# EAGLE schematic Sturingsschakeling_schema_v2.1 (EAGLE 9.7.0)
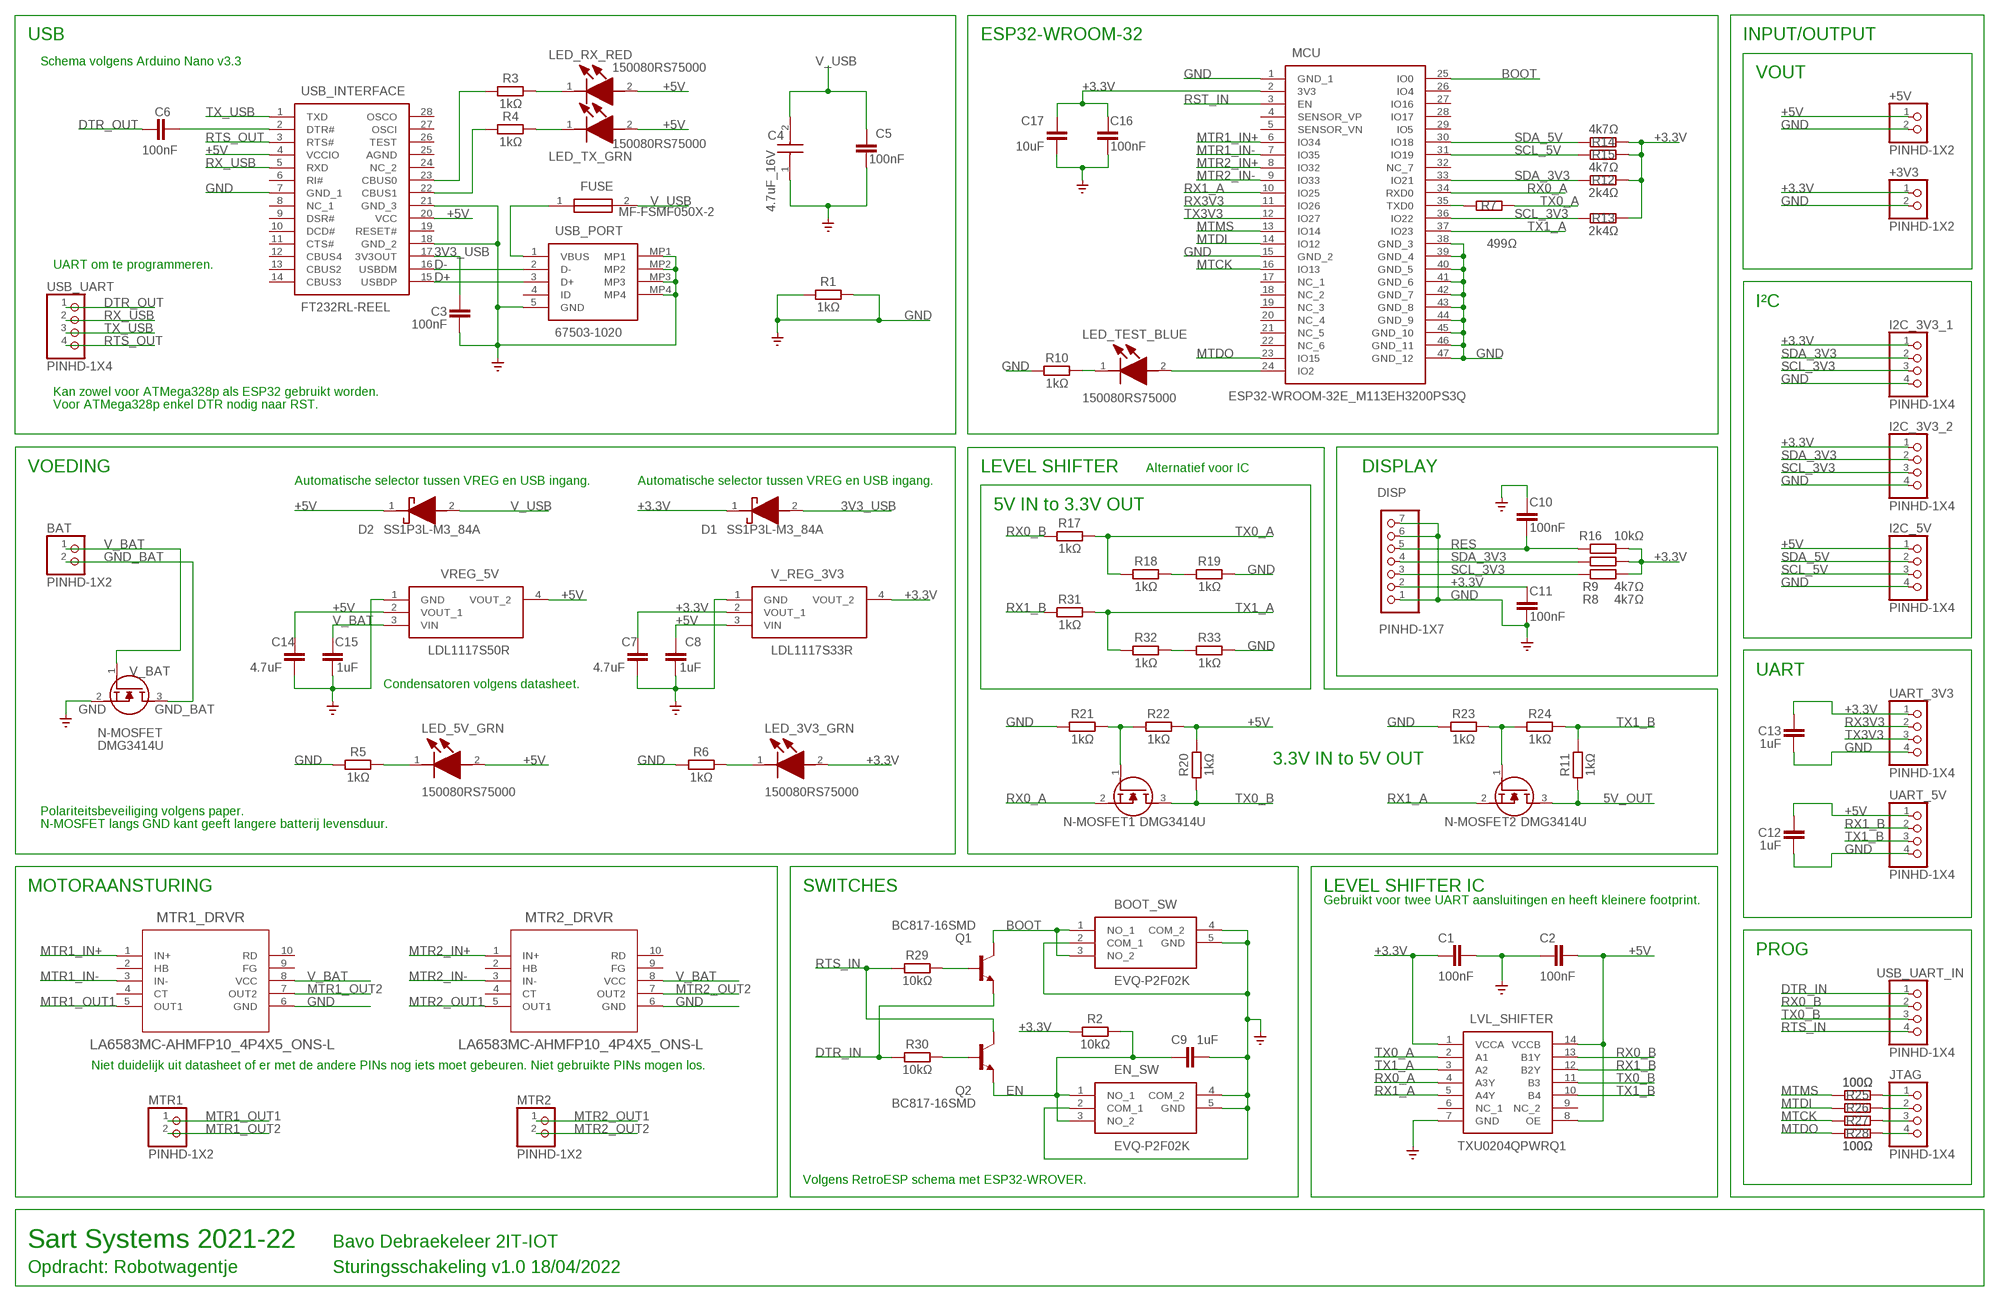
[diagram p0: schematic, sheet 1]

## Parts
+3V3  PINHD-1X2  [1X02]
+5V  PINHD-1X2  [1X02]
BAT  PINHD-1X2  [1X02]
BOOT_SW  EVQ-P2F02K  [EVQP2V02W]
C1  100nF  C_CHIP-0805(2012-METRIC)  [CAPC2012X110]
C2  100nF  C_CHIP-0805(2012-METRIC)  [CAPC2012X110]
C3  100nF  C_CHIP-0805(2012-METRIC)  [CAPC2012X110]
C4  4.7uF_16V  CC0805ZKY5V7BB475  [CAPC2012X145N]
C5  100nF  C_CHIP-0805(2012-METRIC)  [CAPC2012X110]
C6  100nF  C_CHIP-0805(2012-METRIC)  [CAPC2012X110]
C7  4.7uF  C_CHIP-0805(2012-METRIC)  [CAPC2012X110]
C8  1uF  C_CHIP-0805(2012-METRIC)  [CAPC2012X110]
C9  1uF  C_CHIP-0805(2012-METRIC)  [CAPC2012X110]
C10  100nF  C_CHIP-0805(2012-METRIC)  [CAPC2012X110]
C11  100nF  C_CHIP-0805(2012-METRIC)  [CAPC2012X110]
C12  1uF  C_CHIP-0805(2012-METRIC)  [CAPC2012X110]
C13  1uF  C_CHIP-0805(2012-METRIC)  [CAPC2012X110]
C14  4.7uF  C_CHIP-0805(2012-METRIC)  [CAPC2012X110]
C15  1uF  C_CHIP-0805(2012-METRIC)  [CAPC2012X110]
C16  100nF  C_CHIP-0805(2012-METRIC)  [CAPC2012X110]
C17  10uF  C_CHIP-0805(2012-METRIC)  [CAPC2012X110]
D1  SS1P3L-M3_84A  [SS1P3LM384A]
D2  SS1P3L-M3_84A  [SS1P3LM384A]
DISP  PINHD-1X7  [1X07]
EN_SW  EVQ-P2F02K  [EVQP2V02W]
FUSE  MF-FSMF050X-2  [FUSC1608X100N]
I2C_3V3_1  PINHD-1X4  [1X04]
I2C_3V3_2  PINHD-1X4  [1X04]
I2C_5V  PINHD-1X4  [1X04]
JTAG  PINHD-1X4  [1X04]
LED_3V3_GRN  150080RS75000  [LEDC2012X80N]
LED_5V_GRN  150080RS75000  [LEDC2012X80N]
LED_RX_RED  150080RS75000  [LEDC2012X80N]
LED_TEST_BLUE  150080RS75000  [LEDC2012X80N]
LED_TX_GRN  150080RS75000  [LEDC2012X80N]
LVL_SHIFTER  TXU0204QPWRQ1  [SOP65P640X120-14N]
MCU  ESP32-WROOM-32E_M113EH3200PS3Q  [ESP32WROOM32EM113EH3200PS3Q0]
MTR1  PINHD-1X2  [1X02]
MTR1_DRVR  LA6583MC-AHMFP10_4P4X5_ONS-L  [MFP10_4P4X5_ONS-L]
MTR2  PINHD-1X2  [1X02]
MTR2_DRVR  LA6583MC-AHMFP10_4P4X5_ONS-L  [MFP10_4P4X5_ONS-L]
N-MOSFET  DMG3414U  [SOT96P240X110-3N]
N-MOSFET1  DMG3414U  [SOT96P240X110-3N]
N-MOSFET2  DMG3414U  [SOT96P240X110-3N]
Q1  BC817-16SMD  [SOT23-BEC]
Q2  BC817-16SMD  [SOT23-BEC]
R1  1kΩ  R_CHIP-0805(2012-METRIC)  [RESC2012X65]
R2  10kΩ  R_CHIP-0805(2012-METRIC)  [RESC2012X65]
R3  1kΩ  R_CHIP-0805(2012-METRIC)  [RESC2012X65]
R4  1kΩ  R_CHIP-0805(2012-METRIC)  [RESC2012X65]
R5  1kΩ  R_CHIP-0805(2012-METRIC)  [RESC2012X65]
R6  1kΩ  R_CHIP-0805(2012-METRIC)  [RESC2012X65]
R7  499Ω  R_CHIP-0805(2012-METRIC)  [RESC2012X65]
R8  4k7Ω  R_CHIP-0805(2012-METRIC)  [RESC2012X65]
R9  4k7Ω  R_CHIP-0805(2012-METRIC)  [RESC2012X65]
R10  1kΩ  R_CHIP-0805(2012-METRIC)  [RESC2012X65]
R11  1kΩ  R_CHIP-0805(2012-METRIC)  [RESC2012X65]
R12  2k4Ω  R_CHIP-0805(2012-METRIC)  [RESC2012X65]
R13  2k4Ω  R_CHIP-0805(2012-METRIC)  [RESC2012X65]
R14  4k7Ω  R_CHIP-0805(2012-METRIC)  [RESC2012X65]
R15  4k7Ω  R_CHIP-0805(2012-METRIC)  [RESC2012X65]
R16  10kΩ  R_CHIP-0805(2012-METRIC)  [RESC2012X65]
R17  1kΩ  R_CHIP-0805(2012-METRIC)  [RESC2012X65]
R18  1kΩ  R_CHIP-0805(2012-METRIC)  [RESC2012X65]
R19  1kΩ  R_CHIP-0805(2012-METRIC)  [RESC2012X65]
R20  1kΩ  R_CHIP-0805(2012-METRIC)  [RESC2012X65]
R21  1kΩ  R_CHIP-0805(2012-METRIC)  [RESC2012X65]
R22  1kΩ  R_CHIP-0805(2012-METRIC)  [RESC2012X65]
R23  1kΩ  R_CHIP-0805(2012-METRIC)  [RESC2012X65]
R24  1kΩ  R_CHIP-0805(2012-METRIC)  [RESC2012X65]
R25  100Ω  R_CHIP-0805(2012-METRIC)  [RESC2012X65]
R26  100Ω  R_CHIP-0805(2012-METRIC)  [RESC2012X65]
R27  100Ω  R_CHIP-0805(2012-METRIC)  [RESC2012X65]
R28  100Ω  R_CHIP-0805(2012-METRIC)  [RESC2012X65]
R29  10kΩ  R_CHIP-0805(2012-METRIC)  [RESC2012X65]
R30  10kΩ  R_CHIP-0805(2012-METRIC)  [RESC2012X65]
R31  1kΩ  R_CHIP-0805(2012-METRIC)  [RESC2012X65]
R32  1kΩ  R_CHIP-0805(2012-METRIC)  [RESC2012X65]
R33  1kΩ  R_CHIP-0805(2012-METRIC)  [RESC2012X65]
UART_3V3  PINHD-1X4  [1X04]
UART_5V  PINHD-1X4  [1X04]
USB_INTERFACE  FT232RL-REEL  [SOP65P778X200-28N]
USB_PORT  67503-1020  [675031020]
USB_UART  PINHD-1X4  [1X04]
USB_UART_IN  PINHD-1X4  [1X04]
V_REG_3V3  LDL1117S33R  [SOT230P700X180-4N]
VREG_5V  LDL1117S50R  [SOT230P700X180-4N]

## Nets
3V3_USB: C3.2 D1.2(A) USB_INTERFACE.17(3V3OUT)
5V_OUT: N-MOSFET2.3(D) R11.2
+3.3V: +3V3.1 C1.2 C7.2 C11.2 C13.2 C16.2 C17.2 D1.1(K) DISP.2 I2C_3V3_1.1 I2C_3V3_2.1 LED_3V3_GRN.2(A) LVL_SHIFTER.1(VCCA) MCU.2(3V3) R2.2 R8.1 R9.1 R12.1 R13.1 R14.1 R15.1 R16.1 UART_3V3.1 V_REG_3V3.2(VOUT_1) V_REG_3V3.4(VOUT_2)
+5V: +5V.1 C2.1 C8.2 C12.2 C14.2 D2.1(K) I2C_5V.1 LED_5V_GRN.2(A) LED_RX_RED.2(A) LED_TX_GRN.2(A) LVL_SHIFTER.8(OE) LVL_SHIFTER.14(VCCB) R20.1 R22.1 UART_5V.1 USB_INTERFACE.4(VCCIO) USB_INTERFACE.20(VCC) V_REG_3V3.3(VIN) VREG_5V.2(VOUT_1) VREG_5V.4(VOUT_2)
BOOT: BOOT_SW.1(NO_1) BOOT_SW.3(NO_2) MCU.25(IO0) Q1.C
D+: USB_INTERFACE.15(USBDP) USB_PORT.3(D+)
D-: USB_INTERFACE.16(USBDM) USB_PORT.2(D-)
DTR_IN: Q1.E R30.2 USB_UART_IN.1
DTR_OUT: C6.2 USB_UART.1
EN: C9.2 EN_SW.1(NO_1) EN_SW.3(NO_2) Q2.E R2.1
GND: +3V3.2 +5V.2 BOOT_SW.2(COM_1) BOOT_SW.4(COM_2) BOOT_SW.5(GND) C1.1 C2.2 C3.1 C4.1 C5.1 C7.1 C8.1 C9.1 C10.2 C11.1 C12.1 C13.1 C14.1 C15.1 C16.1 C17.1 DISP.1 DISP.6 DISP.7 EN_SW.2(COM_1) EN_SW.4(COM_2) EN_SW.5(GND) I2C_3V3_1.4 I2C_3V3_2.4 I2C_5V.4 LVL_SHIFTER.7(GND) MCU.1(GND_1) MCU.15(GND_2) MCU.38(GND_3) MCU.39(GND_4) MCU.40(GND_5) MCU.41(GND_6) MCU.42(GND_7) MCU.43(GND_8) MCU.44(GND_9) MCU.45(GND_10) MCU.46(GND_11) MCU.47(GND_12) MTR1_DRVR.6(GND) MTR2_DRVR.6(GND) N-MOSFET.2(S) R1.1 R1.2 R5.2 R6.2 R10.2 R19.1 R21.2 R23.2 R33.1 UART_3V3.4 UART_5V.4 USB_INTERFACE.7(GND_1) USB_INTERFACE.18(GND_2) USB_INTERFACE.21(GND_3) USB_PORT.5(GND) USB_PORT.MP1 USB_PORT.MP2 USB_PORT.MP3 USB_PORT.MP4 V_REG_3V3.1(GND) VREG_5V.1(GND) ; supply symbol labelled SUPPLY0_GND_
GND_BAT: BAT.2 N-MOSFET.3(D)
MTCK: MCU.16(IO13) R27.2
MTDI: MCU.14(IO12) R26.2
MTDO: MCU.23(IO15) R28.2
MTMS: MCU.13(IO14) R25.2
MTR1_IN+: MCU.6(IO34) MTR1_DRVR.1(IN+)
MTR1_IN-: MCU.7(IO35) MTR1_DRVR.3(IN-)
MTR1_OUT1: MTR1.1 MTR1_DRVR.5(OUT1)
MTR1_OUT2: MTR1.2 MTR1_DRVR.7(OUT2)
MTR2_IN+: MCU.8(IO32) MTR2_DRVR.1(IN+)
MTR2_IN-: MCU.9(IO33) MTR2_DRVR.3(IN-)
MTR2_OUT1: MTR2.1 MTR2_DRVR.5(OUT1)
MTR2_OUT2: MTR2.2 MTR2_DRVR.7(OUT2)
N$1: C6.1 USB_INTERFACE.2(DTR#)
N$3: MCU.35(TXD0) R7.2
N$6: JTAG.1 R25.1
N$7: N-MOSFET1.1(G) R21.1 R22.2
N$8: R3.2 USB_INTERFACE.23(CBUS0)
N$9: FUSE.1 USB_PORT.1(VBUS)
N$10: R18.1 R19.2
N$11: JTAG.2 R26.1
N$12: R4.2 USB_INTERFACE.22(CBUS1)
N$13: LED_RX_RED.1(K) R3.1
N$14: JTAG.3 R27.1
N$15: JTAG.4 R28.1
N$16: LED_TX_GRN.1(K) R4.1
N$18: Q1.B R29.1
N$19: Q2.B R30.1
N$20: LED_3V3_GRN.1(K) R6.1
N$21: LED_5V_GRN.1(K) R5.1
N$31: LED_TEST_BLUE.2(A) MCU.24(IO2)
N$32: LED_TEST_BLUE.1(K) R10.1
N$34: N-MOSFET2.1(G) R23.1 R24.2
N$35: R32.1 R33.2
RES: C10.1 DISP.5 R16.2
RST_IN: MCU.3(EN)
RTS_IN: Q2.C R29.2 USB_UART_IN.4
RTS_OUT: USB_INTERFACE.3(RTS#) USB_UART.4
RX0_A: LVL_SHIFTER.4(A3Y) MCU.34(RXD0) N-MOSFET1.2(S)
RX0_B: LVL_SHIFTER.13(B1Y) R17.2 USB_UART_IN.2
RX1_A: LVL_SHIFTER.5(A4Y) MCU.10(IO25) N-MOSFET2.2(S)
RX1_B: LVL_SHIFTER.12(B2Y) R31.2 UART_5V.2
RX3V3: MCU.11(IO26) UART_3V3.2
RX_USB: USB_INTERFACE.5(RXD) USB_UART.2
SCL_3V3: DISP.3 I2C_3V3_1.3 I2C_3V3_2.3 MCU.36(IO22) R9.2 R13.2
SCL_5V: I2C_5V.3 MCU.31(IO19) R15.2
SDA_3V3: DISP.4 I2C_3V3_1.2 I2C_3V3_2.2 MCU.33(IO21) R8.2 R12.2
SDA_5V: I2C_5V.2 MCU.30(IO18) R14.2
TX0_A: LVL_SHIFTER.2(A1) R7.1 R17.1 R18.2
TX0_B: LVL_SHIFTER.11(B3) N-MOSFET1.3(D) R20.2 USB_UART_IN.3
TX1_A: LVL_SHIFTER.3(A2) MCU.37(IO23) R31.1 R32.2
TX1_B: LVL_SHIFTER.10(B4) R11.1 R24.1 UART_5V.3
TX3V3: MCU.12(IO27) UART_3V3.3
TX_USB: USB_INTERFACE.1(TXD) USB_UART.3
V_BAT: BAT.1 C15.2 MTR1_DRVR.8(VCC) MTR2_DRVR.8(VCC) N-MOSFET.1(G) VREG_5V.3(VIN)
V_USB: C4.2 C5.2 D2.2(A) FUSE.2
Unconnected: LVL_SHIFTER.6(NC_1) LVL_SHIFTER.9(NC_2) MCU.4(SENSOR_VP) MCU.5(SENSOR_VN) MCU.17(NC_1) MCU.18(NC_2) MCU.19(NC_3) MCU.20(NC_4) MCU.21(NC_5) MCU.22(NC_6) MCU.26(IO4) MCU.27(IO16) MCU.28(IO17) MCU.29(IO5) MCU.32(NC_7) MTR1_DRVR.2(HB) MTR1_DRVR.4(CT) MTR1_DRVR.9(FG) MTR1_DRVR.10(RD) MTR2_DRVR.2(HB) MTR2_DRVR.4(CT) MTR2_DRVR.9(FG) MTR2_DRVR.10(RD) USB_INTERFACE.6(RI#) USB_INTERFACE.8(NC_1) USB_INTERFACE.9(DSR#) USB_INTERFACE.10(DCD#) USB_INTERFACE.11(CTS#) USB_INTERFACE.12(CBUS4) USB_INTERFACE.13(CBUS2) USB_INTERFACE.14(CBUS3) USB_INTERFACE.19(RESET#) USB_INTERFACE.24(NC_2) USB_INTERFACE.25(AGND) USB_INTERFACE.26(TEST) USB_INTERFACE.27(OSCI) USB_INTERFACE.28(OSCO) USB_PORT.4(ID)

## Notes on the sheet
- USB | ESP32-WROOM-32 | INPUT/OUTPUT
- Schema volgens Arduino Nano v3.3
- VOUT
- UART om te programmeren.
- I²C
- Kan zowel voor ATMega328p als ESP32 gebruikt worden.
- Voor ATMega328p enkel DTR nodig naar RST.
- VOEDING | LEVEL SHIFTER | Alternatief voor IC | DISPLAY
- Automatische selector tussen VREG en USB ingang. | Automatische selector tussen VREG en USB ingang.
- 5V IN to 3.3V OUT
- UART
- Condensatoren volgens datasheet.
- 3.3V IN to 5V OUT
- Polariteitsbeveiliging volgens paper.
- N-MOSFET langs GND kant geeft langere batterij levensduur.
- MOTORAANSTURING | SWITCHES | LEVEL SHIFTER IC
- Gebruikt voor twee UART aansluitingen en heeft kleinere footprint.
- PROG
- Niet duidelijk uit datasheet of er met de andere PINs nog iets moet gebeuren. Niet gebruikte PINs mogen los.
- Volgens RetroESP schema met ESP32-WROVER.
- Sart Systems 2021-22 | Bavo Debraekeleer 2IT-IOT
- Opdracht: Robotwagentje | Sturingsschakeling v1.0 18/04/2022

## Library data of the parts
+3V3 +5V BAT MTR1 MTR2 = Connector:PINHD-1X2: PIN HEADER; CATEGORY: CONNECTOR; SUB-CATEGORY: PIN-HEADER
BOOT_SW EN_SW = EVQ-P2F02K:EVQ-P2F02K: Tactile Switches Light Touch Switch 4.7x3.5mm SMD midd Source: Datasheet <https://www.mouser.com/datasheet/2/315/sw_lt_eng_4735s-1288983.pdf>; DESCRIPTION: Tactile Switches Light Touch Switch 4.7x3.5mm SMD midd; HEIGHT: 2.5mm; MANUFACTURER_NAME: Panasonic; MANUFACTURER_PART_NUMBER: EVQ-P2F02K; MOUSER_PART_NUMBER: 667-EVQ-P2F02K; MOUSER_PRICE-STOCK: https://www.mouser.co.uk/ProductDetail/Panasonic/EVQ-P2F02K?qs=WwqriLBepZsV0QucKJ89rg%3D%3D
C1-C3 C5-C17 = Capacitor:C: Capacitor - Generic; CATEGORY: Capacitor
C4 = CC0805ZKY5V7BB475:CC0805ZKY5V7BB475: YAGEO - CC0805ZKY5V7BB475 - SMD Multilayer Ceramic Capacitor, 4.7 F, 16 V, 0805 [2012 Metric], +80%, -20%, Y5V, CC Series Source: Datasheet <https://4donline.ihs.com/images/VipMasterIC/IC/YAGO/YAGO-S-A0004841839/YAGO-S-A0004841839-1.pdf?hkey=6D3A4C79FDBF58556ACFDE234799DDF0>; ARROW_PART_NUMBER: CC0805ZKY5V7BB475; ARROW_PRICE-STOCK: https://www.arrow.com/en/products/cc0805zky5v7bb475/yageo; DESCRIPTION: YAGEO - CC0805ZKY5V7BB475 - SMD Multilayer Ceramic Capacitor, 4.7 F, 16 V, 0805 [2012 Metric], +80%, -20%, Y5V, CC Series; HEIGHT: 1.45mm; MANUFACTURER_NAME: KEMET; MANUFACTURER_PART_NUMBER: CC0805ZKY5V7BB475; MOUSER_PART_NUMBER: 603-CC805ZKY5V7BB475; MOUSER_PRICE-STOCK: https://www.mouser.co.uk/ProductDetail/Yageo/CC0805ZKY5V7BB475?qs=7s%252B3O6pAiyA4wtTM471wUA%3D%3D
D1 D2 = SS1P3L-M3_84A:SS1P3L-M3_84A: Schottky Diodes & Rectifiers 30volt 1.0amp Low VF High Current Density Surface Mount Schottky Barrier Rectifiers Source: Datasheet <https://ms.componentsearchengine.com/Datasheets/2/SS1P3L-M3_84A.pdf>; ARROW_PART_NUMBER: SS1P3L-M3/84A; ARROW_PRICE-STOCK: https://www.arrow.com/en/products/ss1p3l-m384a/vishay?region=nac; DESCRIPTION: Schottky Diodes & Rectifiers 30volt 1.0amp Low VF High Current Density Surface Mount Schottky Barrier Rectifiers; HEIGHT: 1.15mm; MANUFACTURER_NAME: Vishay; MANUFACTURER_PART_NUMBER: SS1P3L-M3/84A; MOUSER_PART_NUMBER: 625-SS1P3L-M3/84A; MOUSER_PRICE-STOCK: https://www.mouser.co.uk/ProductDetail/Vishay-General-Semiconductor/SS1P3L-M3-84A?qs=HSPD0Bff7iZtYrbeCvAZDQ%3D%3D
DISP = Connector:PINHD-1X7: PIN HEADER; CATEGORY: CONNECTOR; SUB-CATEGORY: PIN-HEADER
FUSE = MF-FSMF050X-2:MF-FSMF050X-2: 0603 PTC Resettable Fuses, 6V, 500mA Bourns 0.5A Surface Mount Resettable Fuse, 6 V Source: Datasheet <http://uk.rs-online.com/web/p/products/6927633>; ARROW_PART_NUMBER: MF-FSMF050X-2; ARROW_PRICE-STOCK: https://www.arrow.com/en/products/mf-fsmf050x-2/bourns?region=nac; DESCRIPTION: 0603 PTC Resettable Fuses, 6V, 500mA Bourns 0.5A Surface Mount Resettable Fuse, 6 V; HEIGHT: 1mm; MANUFACTURER_NAME: Bourns; MANUFACTURER_PART_NUMBER: MF-FSMF050X-2; MOUSER_PART_NUMBER: 652-MFFSMF050X-2; MOUSER_PRICE-STOCK: https://www.mouser.co.uk/ProductDetail/Bourns/MF-FSMF050X-2?qs=3QkGRBNOvbrZekaW8Gqm4A%3D%3D
I2C_3V3_1 I2C_3V3_2 I2C_5V JTAG UART_3V3 UART_5V USB_UART USB_UART_IN = Connector:PINHD-1X4: PIN HEADER; CATEGORY: CONNECTOR; SUB-CATEGORY: PIN-HEADER
LED_3V3_GRN LED_5V_GRN LED_RX_RED LED_TEST_BLUE LED_TX_GRN = 150080RS75000:150080RS75000: LED,Wurth Elektronik,150080RS75000 Wurth Elektronik 150080RS75000, WL-SMCW Series Red LED, 625 nm 2012 (0805) Clear, Rectangle Lens SMD package Source: Datasheet <https://componentsearchengine.com/Datasheets/2/150080RS75000.pdf>; DESCRIPTION: LED,Wurth Elektronik,150080RS75000 Wurth Elektronik 150080RS75000, WL-SMCW Series Red LED, 625 nm 2012 (0805) Clear, Rectangle Lens SMD package; HEIGHT: 0.8mm; MANUFACTURER_NAME: Wurth Elektronik; MANUFACTURER_PART_NUMBER: 150080RS75000; MOUSER_PART_NUMBER: 710-150080RS75000; MOUSER_PRICE-STOCK: https://www.mouser.co.uk/ProductDetail/Wurth-Elektronik/150080RS75000?qs=LlUlMxKIyB2jdCo7bnfgew%3D%3D
LVL_SHIFTER = TXU0204QPWRQ1:TXU0204QPWRQ1: Translation - Voltage Levels Automotive four channel unidirectional level shifter Source: Datasheet <https://www.ti.com/lit/ds/symlink/txu0204-q1.pdf?ts=1625421040885&ref_url=https%3A%2F%2Fwww.ti.com%2Fsitesearch%2Fdocs%2Funiversalsearch.tsp%3FlangPref%3Den-US%26searchTerm%3DTXU0204QPWRQ1%26nr%3D3>; ARROW_PART_NUMBER: TXU0204QPWRQ1; ARROW_PRICE-STOCK: https://www.arrow.com/en/products/txu0204qpwrq1/texas-instruments?region=nac; DESCRIPTION: Translation - Voltage Levels Automotive four channel unidirectional level shifter; HEIGHT: 1.2mm; MANUFACTURER_NAME: Texas Instruments; MANUFACTURER_PART_NUMBER: TXU0204QPWRQ1; MOUSER_PART_NUMBER: 595-TXU0204QPWRQ1; MOUSER_PRICE-STOCK: https://www.mouser.co.uk/ProductDetail/Texas-Instruments/TXU0204QPWRQ1?qs=QNEnbhJQKvbo%252BW7%2Fo1U3Qg%3D%3D
MCU = ESP32-WROOM-32E_M113EH3200PS3Q:ESP32-WROOM-32E_M113EH3200PS3Q: WiFi Modules (802.11) SMD module, ESP32-D0WD-V3, ESP32 ECO V3, 4 MB SPI flash, PCB antenna, -40 C ~ +105 C. Source: Datasheet <https://www.espressif.com/sites/default/files/documentation/esp32-wroom-32e_esp32-wroom-32ue_datasheet_en.pdf>; DESCRIPTION: WiFi Modules (802.11) SMD module, ESP32-D0WD-V3, ESP32 ECO V3, 4 MB SPI flash, PCB antenna, -40 C ~ +105 C.; HEIGHT: 3.25mm; MANUFACTURER_NAME: Espressif Systems; MANUFACTURER_PART_NUMBER: ESP32-WROOM-32E(M113EH3200PS3Q0); MOUSER_PART_NUMBER: 356-ESP32WRM320EH3PS; MOUSER_PRICE-STOCK: https://www.mouser.co.uk/ProductDetail/Espressif-Systems/ESP32-WROOM-32EM113EH3200PS3Q0?qs=sPbYRqrBIVkiZhzSFda8%2FA%3D%3D
MTR1_DRVR MTR2_DRVR = 2022-03-20_16-15-33_Library:LA6583MC-AH; COPYRIGHT: Copyright (C) 2022 Ultra Librarian. All rights reserved.; MANUFACTURER_PART_NUMBER: LA6583MC-AH; MFR_NAME: onsemi
N-MOSFET N-MOSFET1 N-MOSFET2 = DMG3414U:DMG3414U: DIODES INC. - DMG3414U - MOSFET, N CH, W DIODE, 20V, 4.2A, SOT23 Source: Datasheet <https://componentsearchengine.com/Datasheets/2/DMG3414U.pdf>; DESCRIPTION: DIODES INC. - DMG3414U - MOSFET, N CH, W DIODE, 20V, 4.2A, SOT23; HEIGHT: 1.1mm; MANUFACTURER_NAME: Diodes Inc.; MANUFACTURER_PART_NUMBER: DMG3414U; MOUSER_PART_NUMBER: N/A; MOUSER_PRICE-STOCK: https://www.mouser.co.uk/ProductDetail/Diodes-Incorporated/DMG3414U?qs=Ledwo0gu0jiKJ4xsXSUnyQ%3D%3D
Q1 Q2 = transistor-npn:BC817*: NPN Transistor
R1-R33 = Resistor:R: Resistor Fixed - Generic; CATEGORY: Resistor; SUB-CATEGORY: Fixed
USB_INTERFACE = FT232RL-REEL:FT232RL-REEL: USB/Serial IC UART SSOP-28 FTDI Chip FT232RL-REEL, USB Controller, 3MBd, USB 2.0, 1.8 5.25 V, 28-Pin SSOP Source: Datasheet <http://www.ftdichip.com/Support/Documents/DataSheets/ICs/DS_FT232R.pdf>; ARROW_PART_NUMBER: FT232RL-REEL; ARROW_PRICE-STOCK: https://www.arrow.com/en/products/ft232rl-reel/ftdi-chip?region=nac; DESCRIPTION: USB/Serial IC UART SSOP-28 FTDI Chip FT232RL-REEL, USB Controller, 3MBd, USB 2.0, 1.8 5.25 V, 28-Pin SSOP; HEIGHT: 2mm; MANUFACTURER_NAME: FTDI Chip; MANUFACTURER_PART_NUMBER: FT232RL-REEL; MOUSER_PART_NUMBER: 895-FT232RL; MOUSER_PRICE-STOCK: https://www.mouser.co.uk/ProductDetail/FTDI/FT232RL-REEL?qs=D1%2FPMqvA103RC6OU6bKtoA%3D%3D
USB_PORT = 67503-1020:67503-1020: USB Connectors USB Mini-B Recept On-The-Go Rt.Angle Source: Datasheet <https://www.molex.com/pdm_docs/sd/675031020_sd.pdf>; DESCRIPTION: USB Connectors USB Mini-B Recept On-The-Go Rt.Angle; HEIGHT: 4.05mm; MANUFACTURER_NAME: Molex; MANUFACTURER_PART_NUMBER: 67503-1020; MOUSER_PART_NUMBER: 538-67503-1020; MOUSER_PRICE-STOCK: https://www.mouser.co.uk/ProductDetail/Molex/67503-1020?qs=7zcQ9RRVJlhHWuXYKEhKMg%3D%3D
V_REG_3V3 = LDL1117S33R:LDL1117S33R: STMICROELECTRONICS - LDL1117S33R - LDO, FIXED, 3.3V, 1.2A, SOT-223-3 Source: Datasheet <https://componentsearchengine.com/Datasheets/2/LDL1117S33R.pdf>; ARROW_PART_NUMBER: LDL1117S33R; ARROW_PRICE-STOCK: https://www.arrow.com/en/products/ldl1117s33r/stmicroelectronics?region=nac; DESCRIPTION: STMICROELECTRONICS - LDL1117S33R - LDO, FIXED, 3.3V, 1.2A, SOT-223-3; HEIGHT: 1.8mm; MANUFACTURER_NAME: STMicroelectronics; MANUFACTURER_PART_NUMBER: LDL1117S33R; MOUSER_PART_NUMBER: 511-LDL1117S33R; MOUSER_PRICE-STOCK: https://www.mouser.co.uk/ProductDetail/STMicroelectronics/LDL1117S33R?qs=AQlKX63v8Rt9Bf6AWSrbFg%3D%3D
VREG_5V = LDL1117S50R:LDL1117S50R: STMICROELECTRONICS - LDL1117S50R - LDO, FIXED, 5V, 1.2A, SOT-223-3 Source: Datasheet <http://www.farnell.com/datasheets/2259188.pdf>; ARROW_PART_NUMBER: LDL1117S50R; ARROW_PRICE-STOCK: https://www.arrow.com/en/products/ldl1117s50r/stmicroelectronics?region=nac; DESCRIPTION: STMICROELECTRONICS - LDL1117S50R - LDO, FIXED, 5V, 1.2A, SOT-223-3; HEIGHT: 1.8mm; MANUFACTURER_NAME: STMicroelectronics; MANUFACTURER_PART_NUMBER: LDL1117S50R; MOUSER_PART_NUMBER: 511-LDL1117S50R; MOUSER_PRICE-STOCK: https://www.mouser.co.uk/ProductDetail/STMicroelectronics/LDL1117S50R?qs=AQlKX63v8RsuN9BQFiVf%2Fg%3D%3D